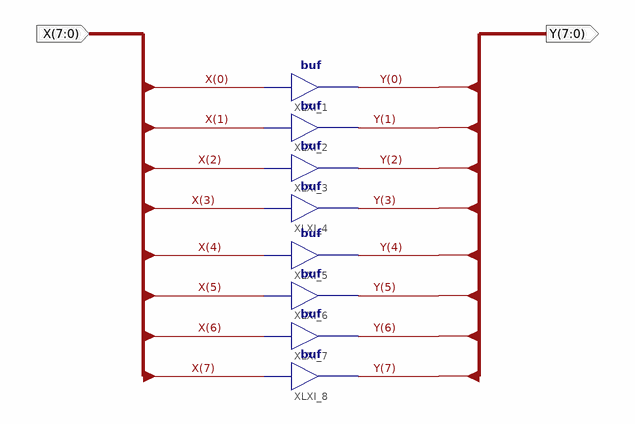
[diagram p0: schematic sheet 1]
// Xilinx ISE schematic Display_LED.sch (spartan6) as structural Verilog: 8 symbols, 2 ports
module Display_LED (
  input  [7:0] X,
  output [7:0] Y
);

  buf XLXI_1 (Y[0], X[0]);
  buf XLXI_2 (Y[1], X[1]);
  buf XLXI_3 (Y[2], X[2]);
  buf XLXI_4 (Y[3], X[3]);
  buf XLXI_5 (Y[4], X[4]);
  buf XLXI_6 (Y[5], X[5]);
  buf XLXI_7 (Y[6], X[6]);
  buf XLXI_8 (Y[7], X[7]);
endmodule
